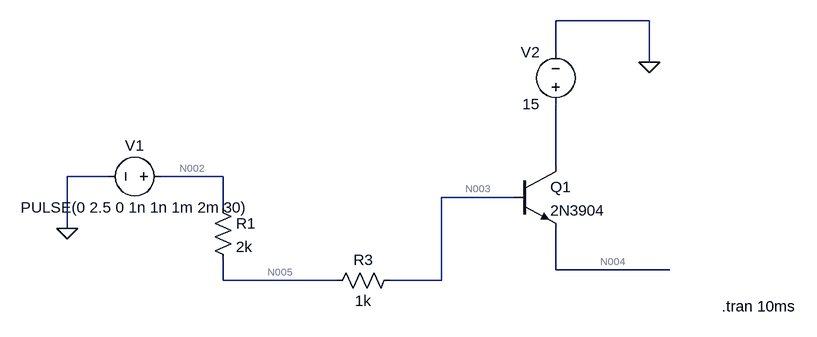
[diagram p0: schematic Draft1.asc]
Draft1.asc, the LTspice schematic file:
Version 4
SHEET 1 920 680
WIRE 672 -128 528 -128
WIRE 528 -80 528 -128
WIRE 672 -64 672 -128
WIRE 528 96 528 0
WIRE -160 112 -224 112
WIRE 16 112 -80 112
WIRE 464 144 352 144
WIRE 16 160 16 112
WIRE -224 192 -224 112
WIRE 528 256 528 192
WIRE 704 256 528 256
WIRE 16 272 16 240
WIRE 192 272 16 272
WIRE 352 272 352 144
WIRE 352 272 272 272
FLAG -224 192 0
FLAG 672 -64 0
SYMBOL Voltage -64 112 R90
WINDOW 0 -32 56 VBottom 2
WINDOW 3 32 56 VTop 2
SYMATTR InstName V1
SYMATTR Value PULSE(0 2.5 0 1n 1n 1m 2m 30)
SYMBOL Res 0 144 R0
SYMATTR InstName R1
SYMATTR Value 2k
SYMBOL Res 288 256 R90
WINDOW 0 0 56 VBottom 2
WINDOW 3 32 56 VTop 2
SYMATTR InstName R3
SYMATTR Value 1k
SYMBOL npn 464 96 R0
SYMATTR InstName Q1
SYMATTR Value 2N3904
SYMBOL Voltage 528 16 R180
WINDOW 0 24 96 Left 2
WINDOW 3 24 16 Left 2
SYMATTR InstName V2
SYMATTR Value 15
TEXT 784 312 Left 2 !.tran 10ms

The netlist it stands for:
* Draft1.asc
V1 N002 0 PULSE(0 2.5 0 1n 1n 1m 2m 30)
R1 N002 N005 2k
R3 N003 N005 1k
Q1 N001 N003 N004 0 2N3904
V2 N001 0 15
.model NPN NPN
.model PNP PNP
.lib standard.bjt
.tran 10ms
.backanno
.end

* Results of the author's LTspice run, read from the files saved beside the schematic
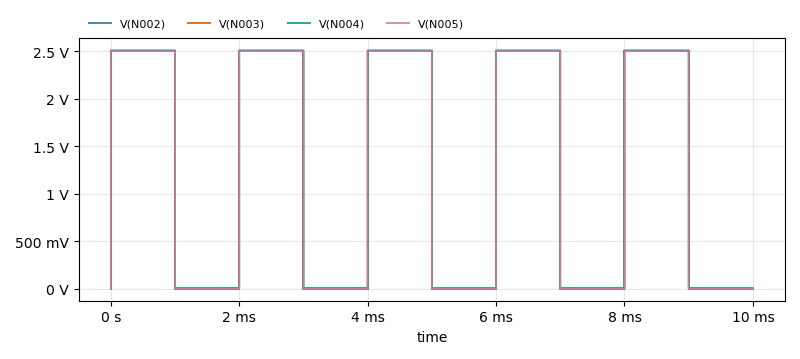
[diagram p1: Transient Analysis of Draft1.asc, plotted from the saved traces]
* Transient Analysis, 1 run:
*   V(N002): min 0 V, max 2.5 V, average 1.25 V, rms 1.768 V, last 0 V
*   V(N003): min -104.5 µV, max 2.5 V, average 1.25 V, rms 1.768 V, last 0 V
*   V(N004): min 8.23 mV, max 2.508 V, average 1.258 V, rms 1.774 V, last 8.336 mV
*   V(N005): min -69.66 µV, max 2.5 V, average 1.25 V, rms 1.768 V, last 0 V